# Altium schematic sheet Additional Documents.SchDoc: =ProjectName
size A3; CodePhone: +380505759863; Author: Hena Chernov; CompanyName: Catcatcat Electronics; SheetNumber: 2; SheetTotal: 10; SheetDescription: Links to additional project documents.; Email: catcatcat.electronics@gmail.com
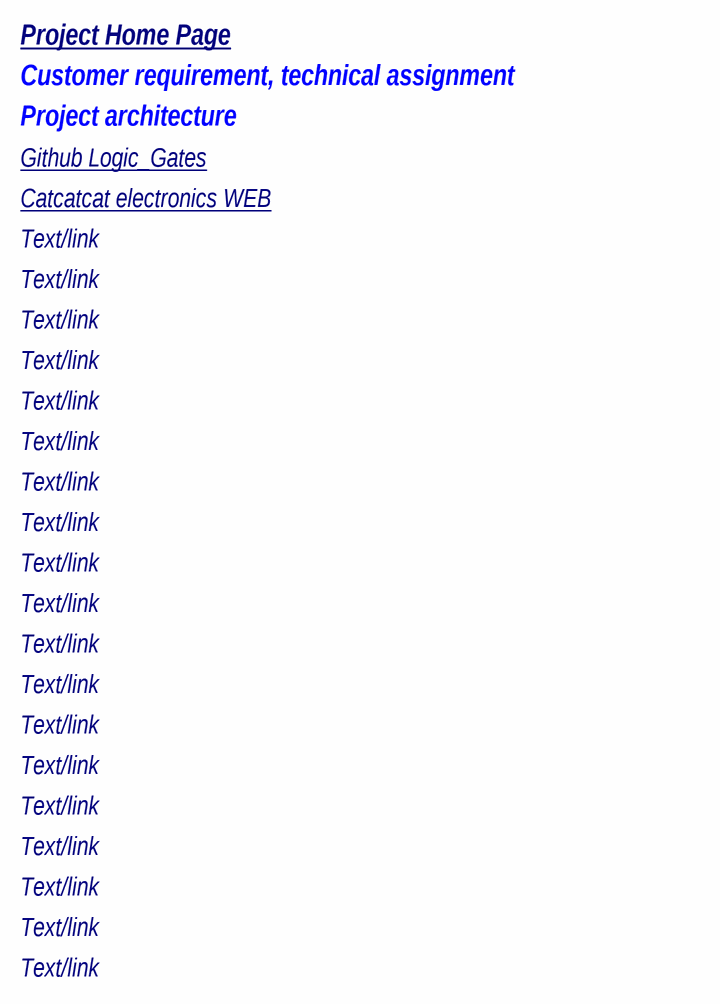
[diagram p0: Additional Documents.SchDoc]

## Notes on the sheet
- Project Home Page <https://catcatcat.d-lan.dp.ua/>
- Project architecture
- Customer requirement, technical assignment
- Github Logic_Gates <https://github.com/CatcatcatElectronics/Logic_Gates>
- Catcatcat electronics WEB <https://catcatcat.d-lan.dp.ua/>
- Text/link
- Document's name/Назва документу (Document link)
- Note: Links to additional technical documents used in the project.
- Project Title:
- Project Version:
- Designed for:
- Lead Project
- Project ID:
- Development company
- Date:
- PCB Revision:
- PCB Name:
- Sheet Title:
- Assembly Variant:
- Time:
- Sheet
- of
- Engineer SCH:
- Engineer PCB:
- Inspection PRJ:
- Size: A3
- File: